# Altium project teensy_Project.PrjPcb
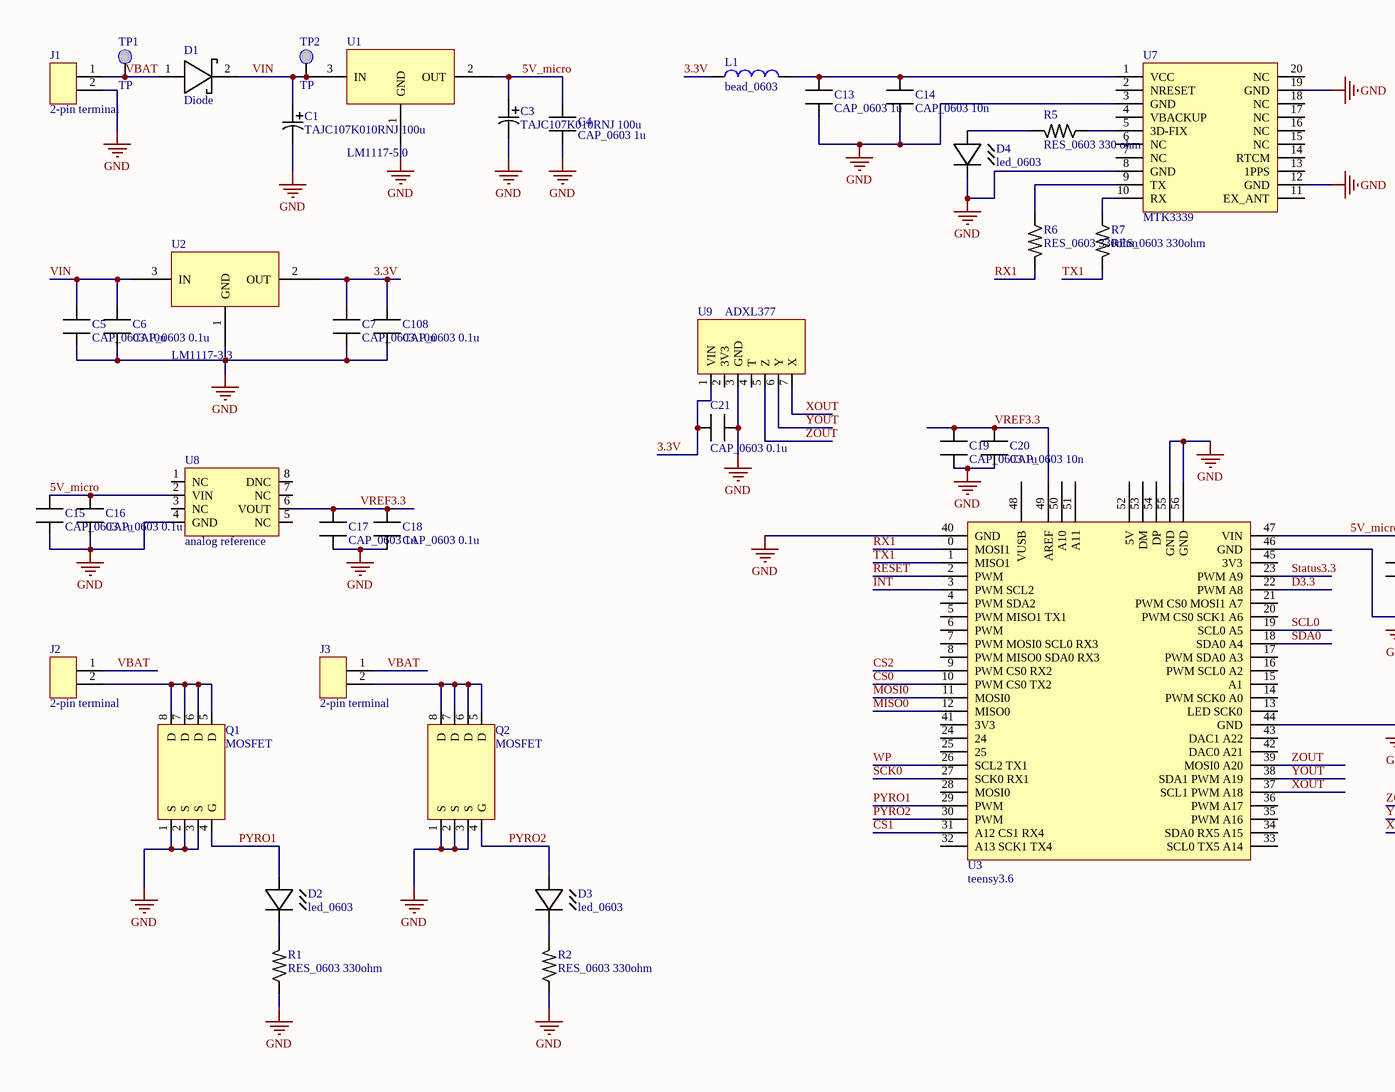
[diagram p0: Sheet1.SchDoc, left]
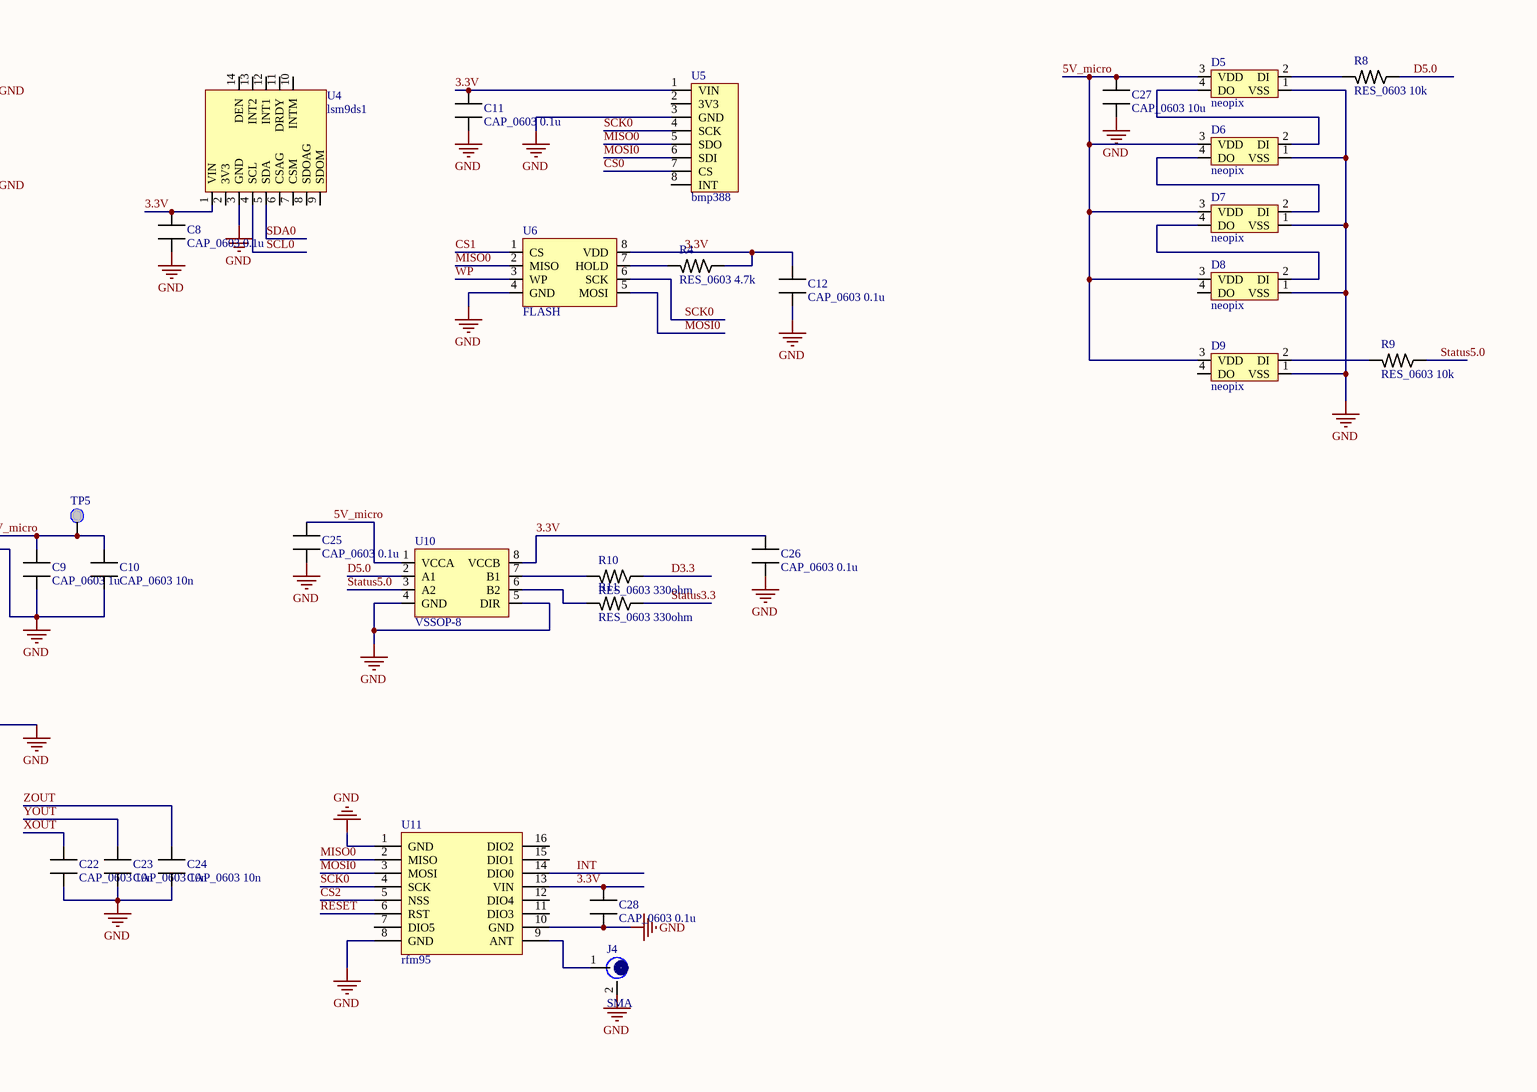
[diagram p1: Sheet1.SchDoc, right]
1 sheet, 68 parts. Net scope: global (net labels, ports and power ports of the same name join across sheets).
Board file: PCB1.PcbDoc

## Sheet Sheet1.SchDoc
size A2

### Parts
C1  TAJC107K010RNJ 100u  [TAJC]
C3  TAJC107K010RNJ 100u  [TAJC]
C4  CAP_0603 1u  [CAP_0603]
C5  CAP_0603 10u  [CAP_0603]
C6  CAP_0603 0.1u  [CAP_0603]
C7  CAP_0603 10u  [CAP_0603]
C8  CAP_0603 0.1u  [CAP_0603]
C9  CAP_0603 1u  [CAP_0603]
C10  CAP_0603 10n  [CAP_0603]
C11  CAP_0603 0.1u  [CAP_0603]
C12  CAP_0603 0.1u  [CAP_0603]
C13  CAP_0603 1u  [CAP_0603]
C14  CAP_0603 10n  [CAP_0603]
C15  CAP_0603 1u  [CAP_0603]
C16  CAP_0603 0.1u  [CAP_0603]
C17  CAP_0603 1u  [CAP_0603]
C18  CAP_0603 0.1u  [CAP_0603]
C19  CAP_0603 1u  [CAP_0603]
C20  CAP_0603 10n  [CAP_0603]
C21  CAP_0603 0.1u  [CAP_0603]
C22  CAP_0603 10n  [CAP_0603]
C23  CAP_0603 10n  [CAP_0603]
C24  CAP_0603 10n  [CAP_0603]
C25  CAP_0603 0.1u  [CAP_0603]
C26  CAP_0603 0.1u  [CAP_0603]
C27  CAP_0603 10u  [CAP_0603]
C28  CAP_0603 0.1u  [CAP_0603]
C108  CAP_0603 0.1u  [CAP_0603]
D1  Diode  [RBR3LAM60BTF_diode]
D2  led_0603  [LED_0603]
D3  led_0603  [LED_0603]
D4  led_0603  [LED_0603]
D5  neopix  [neopix]
D6  neopix  [neopix]
D7  neopix  [neopix]
D8  neopix  [neopix]
D9  neopix  [neopix]
J1  2-pin terminal  [2-pin terminal]
J2  2-pin terminal  [2-pin terminal]
J3  2-pin terminal  [2-pin terminal]
J4  SMA  [SMA]
L1  bead_0603  [BEAD_0603]
Q1  MOSFET  [8-SOIC]
Q2  MOSFET  [8-SOIC]
R1  RES_0603 330ohm  [RES_0603]
R2  RES_0603 330ohm  [RES_0603]
R4  RES_0603 4.7k  [RES_0603]
R5  RES_0603 330 ohm  [RES_0603]
R6  RES_0603 330ohm  [RES_0603]
R7  RES_0603 330ohm  [RES_0603]
R8  RES_0603 10k  [RES_0603]
R9  RES_0603 10k  [RES_0603]
R10  RES_0603 330ohm  [RES_0603]
R11  RES_0603 330ohm  [RES_0603]
TP1  TP  [TP]
TP2  TP  [TP]
TP5  TP  [TP]  (value not drawn)
U1  LM1117-5.0  [LM1117-5.0]
U2  LM1117-3.3  [LM1117-5.0]
U3  teensy3.6  [teensy3.6_1]
U4  lsm9ds1  [lsm9ds1]
U5  bmp388  [bmp388]
U6  FLASH  [8-SOIC]
U7  MTK3339  [MTK3339]
U8  analog reference  [ADR4533]
U9  ADXL377  [ADXL377]
U10  VSSOP-8  [TSOP65P400X130-8M]
U11  rfm95  [rfm95]

### Nets
GND: C1.2 C3.2 C4.1 C5.1 C6.1 C7.1 C8.1 C9.1 C10.1 C11.1 C12.1 C13.1 C14.1 C15.1 C16.1 C17.1 C18.1 C19.1 C20.1 C21.1 C22.1 C23.1 C24.1 C25.1 C26.1 C27.1 C28.1 C108.1 D4.2 D5.1(VSS) D6.1(VSS) D7.1(VSS) D8.1(VSS) D9.1(VSS) J1.2 J4.2(正弦波失真度调整) Q1.1(S) Q1.2(S) Q1.3(S) Q2.1(S) Q2.2(S) Q2.3(S) R1.1 R2.1 U1.1(GND) U2.1(GND) U3.40(GND) U3.44(GND) U3.46(GND) U3.55(GND) U3.56(GND) U4.3(GND) U5.3(GND) U6.4(GND) U7.3(GND) U7.8(GND) U7.12(GND) U7.19(GND) U8.4(GND) U9.3(GND) U10.4(GND) U10.5(DIR) U11.1(GND) U11.8(GND) U11.10(GND)
3.3V: C7.2 C8.2 C11.2 C12.2 C21.2 C26.2 C28.2 C108.2 L1.1 R4.1 U2.2(OUT) U4.1(VIN) U5.1(VIN) U6.8(VDD) U9.1(VIN) U10.8(VCCB) U11.13(VIN)
5V_micro: C3.1 C4.2 C9.2 C10.2 C15.2 C16.2 C25.2 C27.2 D5.3(VDD) D6.3(VDD) D7.3(VDD) D8.3(VDD) D9.3(VDD) TP5.1 U1.2(OUT) U3.47(VIN) U8.2(VIN) U10.1(VCCA)
CS0: U3.10(PWM_CS0_TX2) U5.7(CS)
CS1: U3.31(A12_CS1_RX4) U6.1(CS)
CS2: U3.9(PWM_CS0_RX2) U11.5(NSS)
D3.3: R10.1 U3.22(PWM_A8)
D5.0: R8.1 U10.2(A1)
INT: U3.3(PWM_SCL2) U11.14(DIO0)
MISO0: U3.12(MISO0) U5.5(SDO) U6.2(MISO) U11.2(MISO)
MOSI0: U3.11(MOSI0) U5.6(SDI) U6.5(MOSI) U11.3(MOSI)
PYRO1: D2.1 Q1.4(G) U3.29(PWM)
PYRO2: D3.1 Q2.4(G) U3.30(PWM)
RESET: U3.2(PWM) U11.6(RST)
RX1: R6.2 U3.0(MOSI1)
SCK0: U3.27(SCK0_RX1) U5.4(SCK) U6.6(SCK) U11.4(SCK)
SCL0: U3.19(SCL0_A5) U4.4(SCL)
SDA0: U3.18(SDA0_A4) U4.5(SDA)
Status3.3: R11.1 U3.23(PWM_A9)
Status5.0: R9.1 U10.3(A2)
TX1: R7.2 U3.1(MISO1)
VBAT: D1.1 J1.1 J2.1 J3.1 TP1.1
VIN: C1.1 C5.2 C6.2 D1.2 TP2.1 U1.3(IN) U2.3(IN)
VREF3.3: C17.2 C18.2 C19.2 C20.2 U3.49(AREF) U8.6(VOUT)
WP: U3.26(SCL2_TX1) U6.3(WP)
XOUT: C22.2 U3.37(SCL1_PWM_A18) U9.7(X)
YOUT: C23.2 U3.38(SDA1_PWM_A19) U9.6(Y)
ZOUT: C24.2 U3.39(MOSI0_A20) U9.5(Z)
NetC13_2: C13.2 C14.2 L1.2 U7.1(VCC)
NetD2_2: D2.2 R1.2
NetD3_2: D3.2 R2.2
NetD4_1: D4.1 R5.2
NetD5_2: D5.2(DI) R8.2
NetD5_4: D5.4(DO) D6.2(DI)
NetD6_4: D6.4(DO) D7.2(DI)
NetD7_4: D7.4(DO) D8.2(DI)
NetD9_2: D9.2(DI) R9.2
NetJ2_2: J2.2 Q1.5(D) Q1.6(D) Q1.7(D) Q1.8(D)
NetJ3_2: J3.2 Q2.5(D) Q2.6(D) Q2.7(D) Q2.8(D)
NetJ4_1: J4.1(正弦波失真度调整) U11.9(ANT)
NetR4_2: R4.2 U6.7(HOLD)
NetR5_1: R5.1 U7.5(3D-FIX)
NetR6_1: R6.1 U7.9(TX)
NetR7_1: R7.1 U7.10(RX)
NetR10_2: R10.2 U10.7(B1)
NetR11_2: R11.2 U10.6(B2)

Not connected (* = marked no-connect by the designer): D8 4(DO); D9 4(DO); U3 4(PWM_SDA2) 5(PWM_MISO1_TX1) 6(PWM) 7(PWM_MOSI0_SCL0_RX3) 8(PWM_MISO0_SDA0_RX3) 13(LED_SCK0) 14(PWM_SCK0_A0) 15(A1) 16(PWM_SCL0_A2) 17(PWM_SDA0_A3) 20(PWM_CS0_SCK1_A6) 21(PWM_CS0_MOSI1_A7) 24 25 28(MOSI0) 32(A13_SCK1_TX4) 33(SCL0_TX5_A14) 34(SDA0_RX5_A15) 35(PWM_A16) 36(PWM_A17) 41(3V3) 42(DAC0_A21) 43(DAC1_A22) 45(3V3) 48(VUSB) 50(A10) 51(A11) 52(5V) 53(DM) 54(DP); U4 2(3V3) 6(CSAG) 7(CSM) 8(SDOAG) 9(SDOM) 10(INTM) 11(DRDY) 12(INT1) 13(INT2) 14(DEN); U5 2(3V3) 8(INT); U7 2(NRESET) 4(VBACKUP) 6(NC) 7(NC) 11(EX_ANT) 13(1PPS) 14(RTCM) 15(NC) 16(NC) 17(NC) 18(NC) 20(NC); U8 1(NC) 3(NC) 5(NC) 7(NC) 8(DNC); U9 2(3V3) 4(T); U11 7(DIO5) 11(DIO3) 12(DIO4) 15(DIO1) 16(DIO2)

### Library data of the parts
C1 = TAJC107K010RNJ: 100u; Vendor: AVX Corporation; Built_By: EMA_UL_Team; Type: DEV; Manufacturer_Part_Number: TAJC107K010RNJ; Copyright: Copyright (C) 2018 Accelerated Designs. All rights reserved; RefDes: RefDes; Value: Value; ComponentLink1Description: TAJC107K010RNJ; ComponentLink1URL: https://www.digikey.com/product-detail/en/avx-corporation/TAJC107K010RNJ/478-1704-1-ND/564736
C3 = TAJC107K010RNJ: No Description Available; Vendor: AVX Corporation; Built_By: EMA_UL_Team; Type: DEV; Manufacturer_Part_Number: TAJC107K010RNJ; Copyright: Copyright (C) 2018 Accelerated Designs. All rights reserved; RefDes: RefDes; Value: Value
C4-C28 C108 = CAP_0603
Q1 Q2 = IRL6342TRPBFCT-ND: ComponentLink1Description: MB85RS64V; ComponentLink1URL: https://www.digikey.com/product-detail/en/fujitsu-electronics-america-inc/MB85RS64VPNF-G-JNERE1/865-1260-1-ND/4022676
R1 R2 R4-R11 = RES_0603: RES_0603 1/8 W
U2 = LM1117-5.0
U3 = teensy3.6_1
U6 = MB85RS64V: ComponentLink1Description: MB85RS64V; ComponentLink1URL: https://www.digikey.com/product-detail/en/fujitsu-electronics-america-inc/MB85RS64VPNF-G-JNERE1/865-1260-1-ND/4022676
U8 = ADR4533: ComponentLink1Description: MB85RS64V; ComponentLink1URL: https://www.digikey.com/product-detail/en/fujitsu-electronics-america-inc/MB85RS64VPNF-G-JNERE1/865-1260-1-ND/4022676
U10 = SN74LVC2T45